# Altium schematic sheet LEDChain1.SchDoc
size A; SheetNumber: 2; SheetTotal: 2
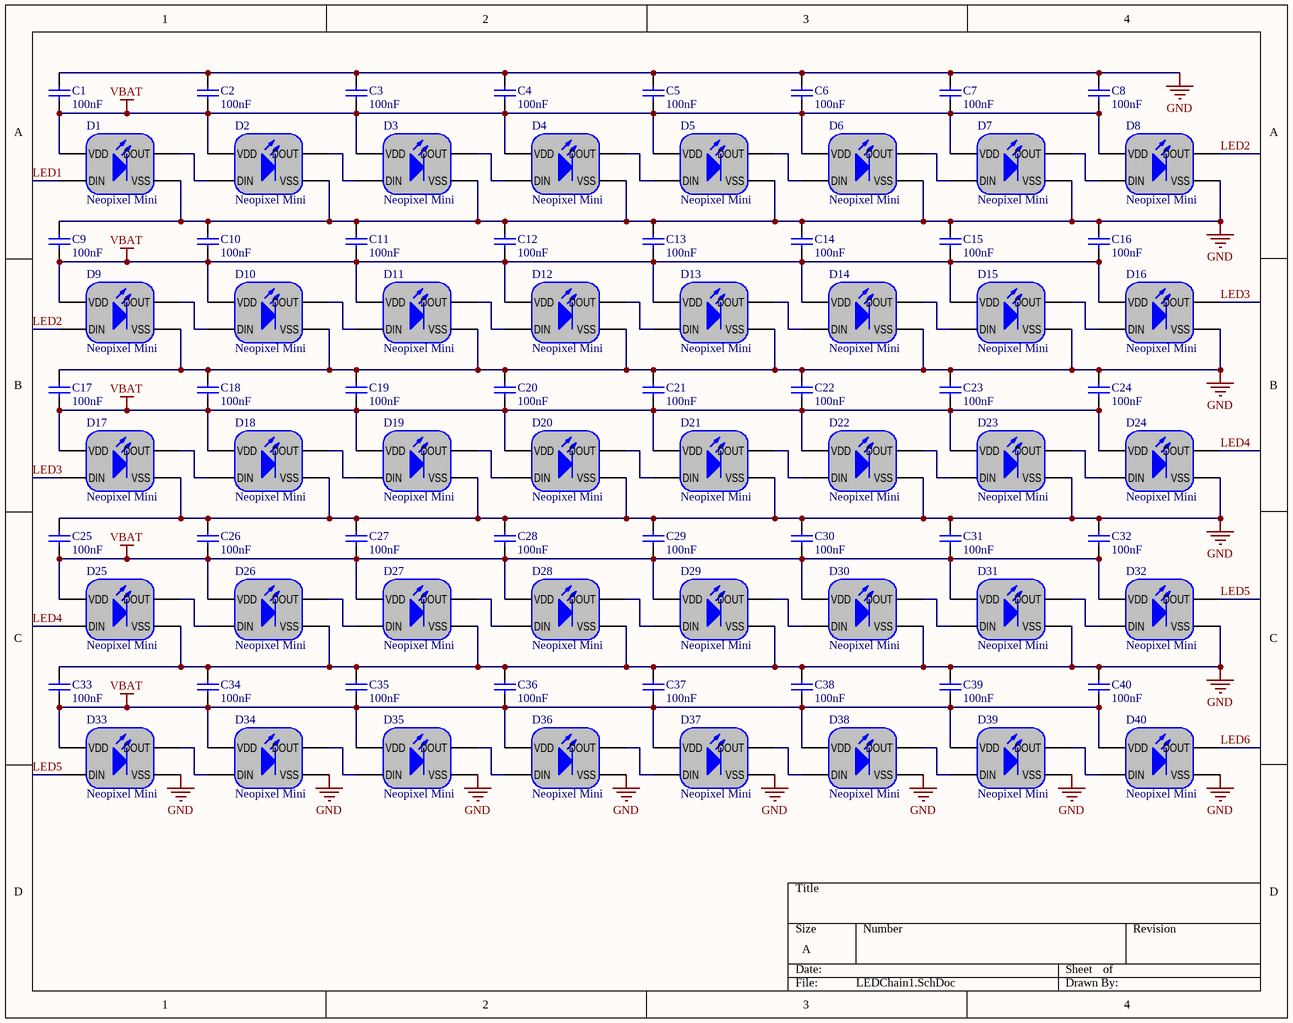
[diagram p0: LEDChain1.SchDoc]

## Parts
C1  100nF  [0402_CAP]
C2  100nF  [0402_CAP]
C3  100nF  [0402_CAP]
C4  100nF  [0402_CAP]
C5  100nF  [0402_CAP]
C6  100nF  [0402_CAP]
C7  100nF  [0402_CAP]
C8  100nF  [0402_CAP]
C9  100nF  [0402_CAP]
C10  100nF  [0402_CAP]
C11  100nF  [0402_CAP]
C12  100nF  [0402_CAP]
C13  100nF  [0402_CAP]
C14  100nF  [0402_CAP]
C15  100nF  [0402_CAP]
C16  100nF  [0402_CAP]
C17  100nF  [0402_CAP]
C18  100nF  [0402_CAP]
C19  100nF  [0402_CAP]
C20  100nF  [0402_CAP]
C21  100nF  [0402_CAP]
C22  100nF  [0402_CAP]
C23  100nF  [0402_CAP]
C24  100nF  [0402_CAP]
C25  100nF  [0402_CAP]
C26  100nF  [0402_CAP]
C27  100nF  [0402_CAP]
C28  100nF  [0402_CAP]
C29  100nF  [0402_CAP]
C30  100nF  [0402_CAP]
C31  100nF  [0402_CAP]
C32  100nF  [0402_CAP]
C33  100nF  [0402_CAP]
C34  100nF  [0402_CAP]
C35  100nF  [0402_CAP]
C36  100nF  [0402_CAP]
C37  100nF  [0402_CAP]
C38  100nF  [0402_CAP]
C39  100nF  [0402_CAP]
C40  100nF  [0402_CAP]
D1  Neopixel Mini  [SK6812 (3535)]
D2  Neopixel Mini  [SK6812 (3535)]
D3  Neopixel Mini  [SK6812 (3535)]
D4  Neopixel Mini  [SK6812 (3535)]
D5  Neopixel Mini  [SK6812 (3535)]
D6  Neopixel Mini  [SK6812 (3535)]
D7  Neopixel Mini  [SK6812 (3535)]
D8  Neopixel Mini  [SK6812 (3535)]
D9  Neopixel Mini  [SK6812 (3535)]
D10  Neopixel Mini  [SK6812 (3535)]
D11  Neopixel Mini  [SK6812 (3535)]
D12  Neopixel Mini  [SK6812 (3535)]
D13  Neopixel Mini  [SK6812 (3535)]
D14  Neopixel Mini  [SK6812 (3535)]
D15  Neopixel Mini  [SK6812 (3535)]
D16  Neopixel Mini  [SK6812 (3535)]
D17  Neopixel Mini  [SK6812 (3535)]
D18  Neopixel Mini  [SK6812 (3535)]
D19  Neopixel Mini  [SK6812 (3535)]
D20  Neopixel Mini  [SK6812 (3535)]
D21  Neopixel Mini  [SK6812 (3535)]
D22  Neopixel Mini  [SK6812 (3535)]
D23  Neopixel Mini  [SK6812 (3535)]
D24  Neopixel Mini  [SK6812 (3535)]
D25  Neopixel Mini  [SK6812 (3535)]
D26  Neopixel Mini  [SK6812 (3535)]
D27  Neopixel Mini  [SK6812 (3535)]
D28  Neopixel Mini  [SK6812 (3535)]
D29  Neopixel Mini  [SK6812 (3535)]
D30  Neopixel Mini  [SK6812 (3535)]
D31  Neopixel Mini  [SK6812 (3535)]
D32  Neopixel Mini  [SK6812 (3535)]
D33  Neopixel Mini  [SK6812 (3535)]
D34  Neopixel Mini  [SK6812 (3535)]
D35  Neopixel Mini  [SK6812 (3535)]
D36  Neopixel Mini  [SK6812 (3535)]
D37  Neopixel Mini  [SK6812 (3535)]
D38  Neopixel Mini  [SK6812 (3535)]
D39  Neopixel Mini  [SK6812 (3535)]
D40  Neopixel Mini  [SK6812 (3535)]

## Nets
GND: C1.2 C2.2 C3.2 C4.2 C5.2 C6.2 C7.2 C8.2 C9.2 C10.2 C11.2 C12.2 C13.2 C14.2 C15.2 C16.2 C17.2 C18.2 C19.2 C20.2 C21.2 C22.2 C23.2 C24.2 C25.2 C26.2 C27.2 C28.2 C29.2 C30.2 C31.2 C32.2 C33.2 C34.2 C35.2 C36.2 C37.2 C38.2 C39.2 C40.2 D1.2(VSS) D2.2(VSS) D3.2(VSS) D4.2(VSS) D5.2(VSS) D6.2(VSS) D7.2(VSS) D8.2(VSS) D9.2(VSS) D10.2(VSS) D11.2(VSS) D12.2(VSS) D13.2(VSS) D14.2(VSS) D15.2(VSS) D16.2(VSS) D17.2(VSS) D18.2(VSS) D19.2(VSS) D20.2(VSS) D21.2(VSS) D22.2(VSS) D23.2(VSS) D24.2(VSS) D25.2(VSS) D26.2(VSS) D27.2(VSS) D28.2(VSS) D29.2(VSS) D30.2(VSS) D31.2(VSS) D32.2(VSS) D33.2(VSS) D34.2(VSS) D35.2(VSS) D36.2(VSS) D37.2(VSS) D38.2(VSS) D39.2(VSS) D40.2(VSS)
VBAT: C1.1 C2.1 C3.1 C4.1 C5.1 C6.1 C7.1 C8.1 C9.1 C10.1 C11.1 C12.1 C13.1 C14.1 C15.1 C16.1 C17.1 C18.1 C19.1 C20.1 C21.1 C22.1 C23.1 C24.1 C25.1 C26.1 C27.1 C28.1 C29.1 C30.1 C31.1 C32.1 C33.1 C34.1 C35.1 C36.1 C37.1 C38.1 C39.1 C40.1 D1.4(VDD) D2.4(VDD) D3.4(VDD) D4.4(VDD) D5.4(VDD) D6.4(VDD) D7.4(VDD) D8.4(VDD) D9.4(VDD) D10.4(VDD) D11.4(VDD) D12.4(VDD) D13.4(VDD) D14.4(VDD) D15.4(VDD) D16.4(VDD) D17.4(VDD) D18.4(VDD) D19.4(VDD) D20.4(VDD) D21.4(VDD) D22.4(VDD) D23.4(VDD) D24.4(VDD) D25.4(VDD) D26.4(VDD) D27.4(VDD) D28.4(VDD) D29.4(VDD) D30.4(VDD) D31.4(VDD) D32.4(VDD) D33.4(VDD) D34.4(VDD) D35.4(VDD) D36.4(VDD) D37.4(VDD) D38.4(VDD) D39.4(VDD) D40.4(VDD)
LED1: D1.3(DIN)
LED2: D8.1(DOUT) D9.3(DIN)
LED3: D16.1(DOUT) D17.3(DIN)
LED4: D24.1(DOUT) D25.3(DIN)
LED5: D32.1(DOUT) D33.3(DIN)
LED6: D40.1(DOUT)
NetD1_1: D1.1(DOUT) D2.3(DIN)
NetD2_1: D2.1(DOUT) D3.3(DIN)
NetD3_1: D3.1(DOUT) D4.3(DIN)
NetD4_1: D4.1(DOUT) D5.3(DIN)
NetD5_1: D5.1(DOUT) D6.3(DIN)
NetD6_1: D6.1(DOUT) D7.3(DIN)
NetD7_1: D7.1(DOUT) D8.3(DIN)
NetD9_1: D9.1(DOUT) D10.3(DIN)
NetD10_1: D10.1(DOUT) D11.3(DIN)
NetD11_1: D11.1(DOUT) D12.3(DIN)
NetD12_1: D12.1(DOUT) D13.3(DIN)
NetD13_1: D13.1(DOUT) D14.3(DIN)
NetD14_1: D14.1(DOUT) D15.3(DIN)
NetD15_1: D15.1(DOUT) D16.3(DIN)
NetD17_1: D17.1(DOUT) D18.3(DIN)
NetD18_1: D18.1(DOUT) D19.3(DIN)
NetD19_1: D19.1(DOUT) D20.3(DIN)
NetD20_1: D20.1(DOUT) D21.3(DIN)
NetD21_1: D21.1(DOUT) D22.3(DIN)
NetD22_1: D22.1(DOUT) D23.3(DIN)
NetD23_1: D23.1(DOUT) D24.3(DIN)
NetD25_1: D25.1(DOUT) D26.3(DIN)
NetD26_1: D26.1(DOUT) D27.3(DIN)
NetD27_1: D27.1(DOUT) D28.3(DIN)
NetD28_1: D28.1(DOUT) D29.3(DIN)
NetD29_1: D29.1(DOUT) D30.3(DIN)
NetD30_1: D30.1(DOUT) D31.3(DIN)
NetD31_1: D31.1(DOUT) D32.3(DIN)
NetD33_1: D33.1(DOUT) D34.3(DIN)
NetD34_1: D34.1(DOUT) D35.3(DIN)
NetD35_1: D35.1(DOUT) D36.3(DIN)
NetD36_1: D36.1(DOUT) D37.3(DIN)
NetD37_1: D37.1(DOUT) D38.3(DIN)
NetD38_1: D38.1(DOUT) D39.3(DIN)
NetD39_1: D39.1(DOUT) D40.3(DIN)

## Library data of the parts
C1-C40 = CAP_100N_0603: CAP CER 0.1UF 16V X7R 0402; Published: 8-Jun-2000; LatestRevisionDate: 17-Jul-2002; LatestRevisionNote: Re-released for DXP Platform.; Publisher: Altium Limited; PackageDescription: Radial Cap, Thru-Hole; 2 Leads; 0.3 in Pin Spacing; PackageReference: RAD-0.3; Supplier 1: Digi-Key; Supplier Part Number 1: 587-1451-1-ND
D1-D40 = SK6812MINI-B-001: ADDRESS LED DISC SERIAL RGB; Supplier 1: Digi-Key; Supplier Part Number 1: 1528-1541-ND